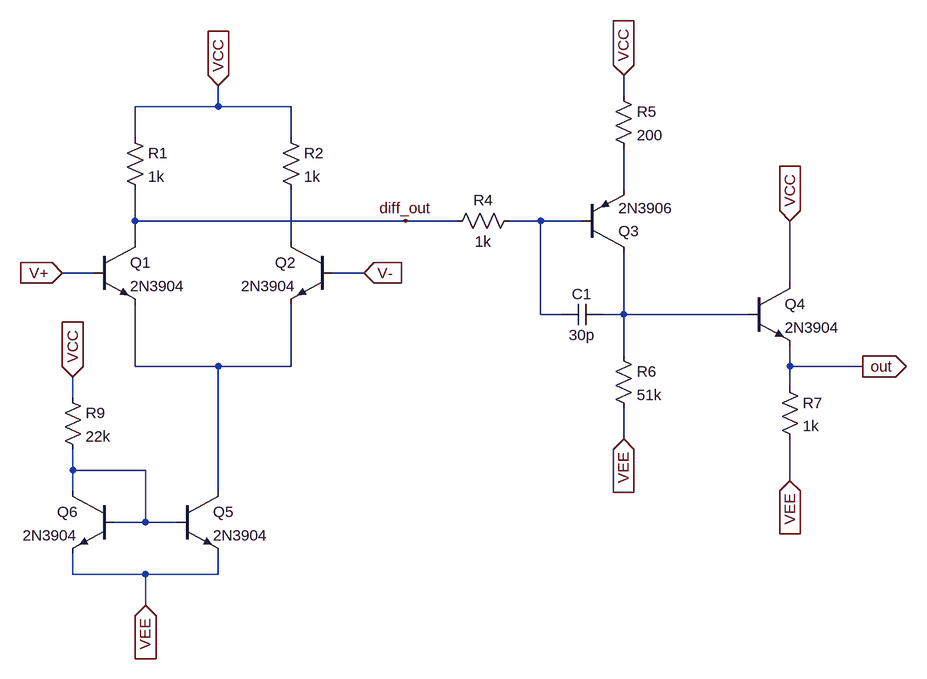
[diagram p0: schematic Giug_Amp_101.asc]
Giug_Amp_101.asc, the LTspice schematic file:
Version 4
SHEET 1 1536 712
WIRE 1072 -176 1072 -208
WIRE 448 -160 448 -192
WIRE 448 -160 320 -160
WIRE 560 -160 448 -160
WIRE 320 -112 320 -160
WIRE 560 -112 560 -160
WIRE 1072 -32 1072 -96
WIRE 320 16 320 -32
WIRE 736 16 320 16
WIRE 816 16 736 16
WIRE 944 16 896 16
WIRE 1008 16 944 16
WIRE 320 48 320 16
WIRE 560 48 560 -32
WIRE 256 96 208 96
WIRE 672 96 624 96
WIRE 1328 112 1328 16
WIRE 944 160 944 16
WIRE 976 160 944 160
WIRE 1072 160 1072 64
WIRE 1072 160 1040 160
WIRE 1264 160 1072 160
WIRE 1072 224 1072 160
WIRE 320 240 320 144
WIRE 448 240 320 240
WIRE 560 240 560 144
WIRE 560 240 448 240
WIRE 1328 240 1328 208
WIRE 1440 240 1328 240
WIRE 1328 272 1328 240
WIRE 224 288 224 256
WIRE 1072 352 1072 304
WIRE 224 400 224 368
WIRE 336 400 224 400
WIRE 1328 416 1328 352
WIRE 224 432 224 400
WIRE 448 432 448 240
WIRE 336 480 336 400
WIRE 336 480 288 480
WIRE 384 480 336 480
WIRE 224 560 224 528
WIRE 336 560 224 560
WIRE 448 560 448 528
WIRE 448 560 336 560
WIRE 336 608 336 560
FLAG 448 -192 VCC
IOPIN 448 -192 In
FLAG 736 16 diff_out
FLAG 1072 -208 VCC
IOPIN 1072 -208 In
FLAG 1328 16 VCC
IOPIN 1328 16 In
FLAG 1440 240 out
IOPIN 1440 240 Out
FLAG 1072 352 VEE
IOPIN 1072 352 In
FLAG 1328 416 VEE
IOPIN 1328 416 In
FLAG 336 608 VEE
IOPIN 336 608 In
FLAG 224 256 VCC
IOPIN 224 256 In
FLAG 672 96 V-
IOPIN 672 96 In
FLAG 208 96 V+
IOPIN 208 96 In
SYMBOL res 304 -128 R0
SYMATTR InstName R1
SYMATTR Value 1k
SYMBOL res 544 -128 R0
SYMATTR InstName R2
SYMATTR Value 1k
SYMBOL npn 256 48 R0
SYMATTR InstName Q1
SYMATTR Value 2N3904
SYMBOL npn 624 48 M0
SYMATTR InstName Q2
SYMATTR Value 2N3904
SYMBOL res 912 0 R90
WINDOW 0 0 56 VBottom 2
WINDOW 3 32 56 VTop 2
SYMATTR InstName R4
SYMATTR Value 1k
SYMBOL pnp 1008 64 M180
SYMATTR InstName Q3
SYMATTR Value 2N3906
SYMBOL res 1056 -192 R0
SYMATTR InstName R5
SYMATTR Value 200
SYMBOL cap 1040 144 R90
WINDOW 0 0 32 VBottom 2
WINDOW 3 32 32 VTop 2
SYMATTR InstName C1
SYMATTR Value 30p
SYMBOL res 1056 208 R0
SYMATTR InstName R6
SYMATTR Value 51k
SYMBOL npn 1264 112 R0
SYMATTR InstName Q4
SYMATTR Value 2N3904
SYMBOL res 1312 256 R0
SYMATTR InstName R7
SYMATTR Value 1k
SYMBOL npn 384 432 R0
SYMATTR InstName Q5
SYMATTR Value 2N3904
SYMBOL npn 288 432 M0
SYMATTR InstName Q6
SYMATTR Value 2N3904
SYMBOL res 208 272 R0
SYMATTR InstName R9
SYMATTR Value 22k

The netlist it stands for:
* Giug_Amp_101.asc
R1 VCC diff_out 1k
R2 VCC N003 1k
Q1 diff_out V+ N005 0 2N3904
Q2 N003 V- N005 0 2N3904
R4 N002 diff_out 1k
Q3 N004 N002 N001 0 2N3906
R5 VCC N001 200
C1 N004 N002 30p
R6 N004 VEE 51k
Q4 VCC N004 out 0 2N3904
R7 out VEE 1k
Q5 N005 N006 VEE 0 2N3904
Q6 N006 N006 VEE 0 2N3904
R9 VCC N006 22k
.model NPN NPN
.model PNP PNP
.lib standard.bjt
.backanno
.end